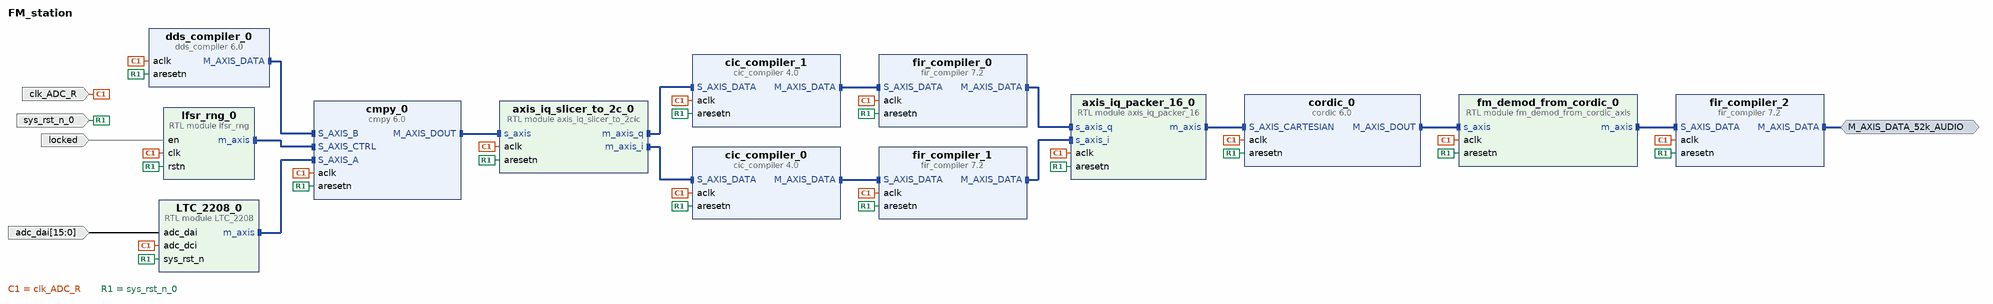
[diagram p0: block diagram of the top level]
# Vivado block design FM_station, xc7z020clg400-2, Vivado 2023.2
create_bd_design FM_station

create_bd_intf_port -mode Master -vlnv xilinx.com:interface:axis_rtl:1.0 M_AXIS_DATA_52k_AUDIO
set_property -dict {CONFIG.FREQ_HZ 130000000} [get_bd_intf_ports M_AXIS_DATA_52k_AUDIO]
create_bd_port -dir I -type clk clk_ADC_R
set_property -dict {CONFIG.FREQ_HZ 130000000} [get_bd_ports clk_ADC_R]
create_bd_port -dir I -type rst sys_rst_n_0
create_bd_port -dir I -from 15 -to 0 adc_dai
create_bd_port -dir I locked

create_bd_cell -type ip -vlnv xilinx.com:ip:dds_compiler:6.0 dds_compiler_0
set_property -dict [list \
  CONFIG.DDS_Clock_Rate 130 \
  CONFIG.DSP48_Use Maximal \
  CONFIG.Frequency_Resolution 0.4 \
  CONFIG.Has_ARESETn true \
  CONFIG.Has_Phase_Out false \
  CONFIG.Latency 9 \
  CONFIG.M_DATA_Has_TUSER Not_Required \
  CONFIG.Mode_of_Operation Standard \
  CONFIG.Negative_Sine true \
  CONFIG.Noise_Shaping None \
  CONFIG.Optimization_Goal Speed \
  CONFIG.Output_Frequency1 0 \
  CONFIG.Output_Width 16 \
  CONFIG.PINC1 01001101001100011001111111100111 \
  CONFIG.Parameter_Entry Hardware_Parameters \
  CONFIG.Phase_Width 32 \
] [get_bd_cells dds_compiler_0]
create_bd_cell -type ip -vlnv xilinx.com:ip:cmpy:6.0 cmpy_0
set_property -dict [list \
  CONFIG.ARESETN true \
  CONFIG.FlowControl Blocking \
  CONFIG.MinimumLatency 7 \
  CONFIG.OptimizeGoal Performance \
  CONFIG.OutputWidth 16 \
  CONFIG.RoundMode Random_Rounding \
] [get_bd_cells cmpy_0]
create_bd_cell -type module -reference LTC_2208 LTC_2208_0
create_bd_cell -type module -reference lfsr_rng lfsr_rng_0
create_bd_cell -type ip -vlnv xilinx.com:ip:cic_compiler:4.0 cic_compiler_0
set_property -dict [list \
  CONFIG.Clock_Frequency 130 \
  CONFIG.Filter_Type Decimation \
  CONFIG.Fixed_Or_Initial_Rate 50 \
  CONFIG.HAS_ARESETN true \
  CONFIG.HAS_DOUT_TREADY true \
  CONFIG.Input_Data_Width 16 \
  CONFIG.Input_Sample_Frequency 130 \
  CONFIG.Maximum_Rate 50 \
  CONFIG.Minimum_Rate 50 \
  CONFIG.Number_Of_Channels 1 \
  CONFIG.Number_Of_Stages 5 \
  CONFIG.Output_Data_Width 32 \
  CONFIG.Passband_Max 0.08 \
  CONFIG.Quantization Truncation \
  CONFIG.Response_Magnitude Normalized \
  CONFIG.SamplePeriod 1 \
  CONFIG.Stopband_Min 0.2 \
] [get_bd_cells cic_compiler_0]
create_bd_cell -type ip -vlnv xilinx.com:ip:cic_compiler:4.0 cic_compiler_1
set_property -dict [list \
  CONFIG.Clock_Frequency 130 \
  CONFIG.Filter_Type Decimation \
  CONFIG.Fixed_Or_Initial_Rate 50 \
  CONFIG.HAS_ARESETN true \
  CONFIG.HAS_DOUT_TREADY true \
  CONFIG.Input_Data_Width 16 \
  CONFIG.Input_Sample_Frequency 130 \
  CONFIG.Maximum_Rate 50 \
  CONFIG.Minimum_Rate 50 \
  CONFIG.Number_Of_Channels 1 \
  CONFIG.Number_Of_Stages 5 \
  CONFIG.Output_Data_Width 32 \
  CONFIG.Passband_Max 0.08 \
  CONFIG.Quantization Truncation \
  CONFIG.Response_Magnitude Normalized \
  CONFIG.SamplePeriod 1 \
  CONFIG.Stopband_Min 0.2 \
] [get_bd_cells cic_compiler_1]
create_bd_cell -type module -reference axis_iq_slicer_to_2cic axis_iq_slicer_to_2c_0
create_bd_cell -type ip -vlnv xilinx.com:ip:fir_compiler:7.2 fir_compiler_0
set_property -dict [list \
  CONFIG.Channel_Sequence Basic \
  CONFIG.Clock_Frequency 130 \
  CONFIG.CoefficientSource COE_File \
  CONFIG.Coefficient_Fanout true \
  CONFIG.Coefficient_File ../../../../../../1.coe \
  CONFIG.Coefficient_Fractional_Bits 0 \
  CONFIG.Coefficient_Sets 1 \
  CONFIG.Coefficient_Sign Signed \
  CONFIG.Coefficient_Structure Inferred \
  CONFIG.Coefficient_Width 16 \
  CONFIG.Control_Broadcast_Fanout true \
  CONFIG.Control_Column_Fanout true \
  CONFIG.Control_LUT_Pipeline true \
  CONFIG.Control_Path_Fanout true \
  CONFIG.DATA_Has_TLAST Not_Required \
  CONFIG.Data_Path_Broadcast false \
  CONFIG.Data_Path_Fanout true \
  CONFIG.Decimation_Rate 5 \
  CONFIG.Disable_Half_Band_Centre_Tap false \
  CONFIG.Filter_Architecture Systolic_Multiply_Accumulate \
  CONFIG.Filter_Type Decimation \
  CONFIG.Has_ARESETn true \
  CONFIG.Interpolation_Rate 1 \
  CONFIG.M_DATA_Has_TREADY true \
  CONFIG.M_DATA_Has_TUSER Not_Required \
  CONFIG.No_BRAM_Read_First_Mode true \
  CONFIG.No_SRL_Attributes false \
  CONFIG.Number_Channels 1 \
  CONFIG.Optimal_Column_Lengths true \
  CONFIG.Optimization_Goal Speed \
  CONFIG.Optimization_List Data_Path_Fanout,Pre-Adder_Pipeline,Coefficient_Fanout,Control_Path_Fanout,Control_Column_Fanout,Control_Broadcast_Fanout,Control_LUT_Pipeline,No_BRAM_Read_First_Mode,Optimal_Column_Lengths,Other \
  CONFIG.Optimization_Selection All \
  CONFIG.Other true \
  CONFIG.Output_Rounding_Mode Convergent_Rounding_to_Even \
  CONFIG.Output_Width 16 \
  CONFIG.Pre_Adder_Pipeline true \
  CONFIG.Quantization Integer_Coefficients \
  CONFIG.RateSpecification Frequency_Specification \
  CONFIG.S_DATA_Has_TUSER Not_Required \
  CONFIG.Sample_Frequency 2.6 \
  CONFIG.Select_Pattern All \
  CONFIG.Zero_Pack_Factor 1 \
] [get_bd_cells fir_compiler_0]
create_bd_cell -type ip -vlnv xilinx.com:ip:fir_compiler:7.2 fir_compiler_1
set_property -dict [list \
  CONFIG.Channel_Sequence Basic \
  CONFIG.Clock_Frequency 130 \
  CONFIG.CoefficientSource COE_File \
  CONFIG.Coefficient_Fanout true \
  CONFIG.Coefficient_File ../../../../../../1.coe \
  CONFIG.Coefficient_Fractional_Bits 0 \
  CONFIG.Coefficient_Sets 1 \
  CONFIG.Coefficient_Sign Signed \
  CONFIG.Coefficient_Structure Inferred \
  CONFIG.Coefficient_Width 16 \
  CONFIG.Control_Broadcast_Fanout true \
  CONFIG.Control_Column_Fanout true \
  CONFIG.Control_LUT_Pipeline true \
  CONFIG.Control_Path_Fanout true \
  CONFIG.DATA_Has_TLAST Not_Required \
  CONFIG.Data_Path_Broadcast false \
  CONFIG.Data_Path_Fanout true \
  CONFIG.Decimation_Rate 5 \
  CONFIG.Disable_Half_Band_Centre_Tap false \
  CONFIG.Filter_Architecture Systolic_Multiply_Accumulate \
  CONFIG.Filter_Type Decimation \
  CONFIG.Has_ARESETn true \
  CONFIG.Interpolation_Rate 1 \
  CONFIG.M_DATA_Has_TREADY true \
  CONFIG.M_DATA_Has_TUSER Not_Required \
  CONFIG.No_BRAM_Read_First_Mode true \
  CONFIG.No_SRL_Attributes false \
  CONFIG.Number_Channels 1 \
  CONFIG.Optimal_Column_Lengths true \
  CONFIG.Optimization_Goal Speed \
  CONFIG.Optimization_List Data_Path_Fanout,Pre-Adder_Pipeline,Coefficient_Fanout,Control_Path_Fanout,Control_Column_Fanout,Control_Broadcast_Fanout,Control_LUT_Pipeline,No_BRAM_Read_First_Mode,Optimal_Column_Lengths,Other \
  CONFIG.Optimization_Selection All \
  CONFIG.Other true \
  CONFIG.Output_Rounding_Mode Convergent_Rounding_to_Even \
  CONFIG.Output_Width 16 \
  CONFIG.Pre_Adder_Pipeline true \
  CONFIG.Quantization Integer_Coefficients \
  CONFIG.RateSpecification Frequency_Specification \
  CONFIG.S_DATA_Has_TUSER Not_Required \
  CONFIG.Sample_Frequency 2.6 \
  CONFIG.Select_Pattern All \
  CONFIG.Zero_Pack_Factor 1 \
] [get_bd_cells fir_compiler_1]
create_bd_cell -type ip -vlnv xilinx.com:ip:cordic:6.0 cordic_0
set_property -dict [list \
  CONFIG.ARESETN true \
  CONFIG.Compensation_Scaling BRAM \
  CONFIG.Data_Format SignedFraction \
  CONFIG.Functional_Selection Translate \
  CONFIG.Round_Mode Nearest_Even \
  CONFIG.flow_control Blocking \
  CONFIG.out_tready true \
] [get_bd_cells cordic_0]
create_bd_cell -type module -reference axis_iq_packer_16 axis_iq_packer_16_0
create_bd_cell -type module -reference fm_demod_from_cordic_axis fm_demod_from_cordic_0
create_bd_cell -type ip -vlnv xilinx.com:ip:fir_compiler:7.2 fir_compiler_2
set_property -dict [list \
  CONFIG.Channel_Sequence Basic \
  CONFIG.Clock_Frequency 130 \
  CONFIG.CoefficientSource COE_File \
  CONFIG.Coefficient_Fanout true \
  CONFIG.Coefficient_File ../../../../../../../../520k_to_52k.coe \
  CONFIG.Coefficient_Fractional_Bits 0 \
  CONFIG.Coefficient_Sets 1 \
  CONFIG.Coefficient_Sign Signed \
  CONFIG.Coefficient_Structure Inferred \
  CONFIG.Coefficient_Width 16 \
  CONFIG.Control_Broadcast_Fanout true \
  CONFIG.Control_Column_Fanout true \
  CONFIG.Control_LUT_Pipeline true \
  CONFIG.Control_Path_Fanout true \
  CONFIG.DATA_Has_TLAST Not_Required \
  CONFIG.Data_Path_Broadcast false \
  CONFIG.Data_Path_Fanout true \
  CONFIG.Decimation_Rate 10 \
  CONFIG.Disable_Half_Band_Centre_Tap false \
  CONFIG.Filter_Architecture Systolic_Multiply_Accumulate \
  CONFIG.Filter_Type Decimation \
  CONFIG.Has_ARESETn true \
  CONFIG.Interpolation_Rate 1 \
  CONFIG.M_DATA_Has_TREADY true \
  CONFIG.M_DATA_Has_TUSER Not_Required \
  CONFIG.No_BRAM_Read_First_Mode true \
  CONFIG.No_SRL_Attributes false \
  CONFIG.Number_Channels 1 \
  CONFIG.Optimal_Column_Lengths true \
  CONFIG.Optimization_Goal Speed \
  CONFIG.Optimization_List Data_Path_Fanout,Pre-Adder_Pipeline,Coefficient_Fanout,Control_Path_Fanout,Control_Column_Fanout,Control_Broadcast_Fanout,Control_LUT_Pipeline,No_BRAM_Read_First_Mode,Optimal_Column_Lengths,Other \
  CONFIG.Optimization_Selection All \
  CONFIG.Other true \
  CONFIG.Output_Rounding_Mode Convergent_Rounding_to_Even \
  CONFIG.Output_Width 16 \
  CONFIG.Pre_Adder_Pipeline true \
  CONFIG.Quantization Integer_Coefficients \
  CONFIG.RateSpecification Frequency_Specification \
  CONFIG.S_DATA_Has_TUSER Not_Required \
  CONFIG.Sample_Frequency 0.52 \
  CONFIG.Select_Pattern All \
  CONFIG.Zero_Pack_Factor 1 \
] [get_bd_cells fir_compiler_2]

# ---- connections ----

connect_bd_intf_net [get_bd_intf_pins LTC_2208_0/m_axis] [get_bd_intf_pins cmpy_0/S_AXIS_A]
connect_bd_intf_net [get_bd_intf_pins axis_iq_packer_16_0/m_axis] [get_bd_intf_pins cordic_0/S_AXIS_CARTESIAN]
connect_bd_intf_net [get_bd_intf_pins axis_iq_slicer_to_2c_0/m_axis_i] [get_bd_intf_pins cic_compiler_0/S_AXIS_DATA]
connect_bd_intf_net [get_bd_intf_pins axis_iq_slicer_to_2c_0/m_axis_q] [get_bd_intf_pins cic_compiler_1/S_AXIS_DATA]
connect_bd_intf_net [get_bd_intf_pins cic_compiler_0/M_AXIS_DATA] [get_bd_intf_pins fir_compiler_1/S_AXIS_DATA]
connect_bd_intf_net [get_bd_intf_pins cic_compiler_1/M_AXIS_DATA] [get_bd_intf_pins fir_compiler_0/S_AXIS_DATA]
connect_bd_intf_net [get_bd_intf_pins cmpy_0/M_AXIS_DOUT] [get_bd_intf_pins axis_iq_slicer_to_2c_0/s_axis]
connect_bd_intf_net [get_bd_intf_pins cordic_0/M_AXIS_DOUT] [get_bd_intf_pins fm_demod_from_cordic_0/s_axis]
connect_bd_intf_net [get_bd_intf_pins dds_compiler_0/M_AXIS_DATA] [get_bd_intf_pins cmpy_0/S_AXIS_B]
connect_bd_intf_net [get_bd_intf_pins axis_iq_packer_16_0/s_axis_q] [get_bd_intf_pins fir_compiler_0/M_AXIS_DATA]
connect_bd_intf_net [get_bd_intf_pins axis_iq_packer_16_0/s_axis_i] [get_bd_intf_pins fir_compiler_1/M_AXIS_DATA]
connect_bd_intf_net [get_bd_intf_ports M_AXIS_DATA_52k_AUDIO] [get_bd_intf_pins fir_compiler_2/M_AXIS_DATA]
connect_bd_intf_net [get_bd_intf_pins fir_compiler_2/S_AXIS_DATA] [get_bd_intf_pins fm_demod_from_cordic_0/m_axis]
connect_bd_intf_net [get_bd_intf_pins lfsr_rng_0/m_axis] [get_bd_intf_pins cmpy_0/S_AXIS_CTRL]
connect_bd_net -net aclk_0_1 [get_bd_ports clk_ADC_R] \
  [get_bd_pins dds_compiler_0/aclk] [get_bd_pins cmpy_0/aclk] [get_bd_pins lfsr_rng_0/clk] \
  [get_bd_pins axis_iq_slicer_to_2c_0/aclk] [get_bd_pins cic_compiler_1/aclk] [get_bd_pins cic_compiler_0/aclk] \
  [get_bd_pins fir_compiler_1/aclk] [get_bd_pins fir_compiler_0/aclk] [get_bd_pins cordic_0/aclk] \
  [get_bd_pins axis_iq_packer_16_0/aclk] [get_bd_pins fm_demod_from_cordic_0/aclk] [get_bd_pins fir_compiler_2/aclk] \
  [get_bd_pins LTC_2208_0/adc_dci]
connect_bd_net -net adc_dai_0_1 [get_bd_ports adc_dai] [get_bd_pins LTC_2208_0/adc_dai]
connect_bd_net -net en_0_1 [get_bd_ports locked] [get_bd_pins lfsr_rng_0/en]
connect_bd_net -net sys_rst_n_0_1 [get_bd_ports sys_rst_n_0] \
  [get_bd_pins dds_compiler_0/aresetn] [get_bd_pins cmpy_0/aresetn] [get_bd_pins lfsr_rng_0/rstn] \
  [get_bd_pins axis_iq_slicer_to_2c_0/aresetn] [get_bd_pins cic_compiler_1/aresetn] [get_bd_pins cic_compiler_0/aresetn] \
  [get_bd_pins fir_compiler_1/aresetn] [get_bd_pins fir_compiler_0/aresetn] [get_bd_pins cordic_0/aresetn] \
  [get_bd_pins axis_iq_packer_16_0/aresetn] [get_bd_pins fm_demod_from_cordic_0/aresetn] [get_bd_pins fir_compiler_2/aresetn] \
  [get_bd_pins LTC_2208_0/sys_rst_n]

validate_bd_design
save_bd_design
